# EAGLE design Artemis Corner Board V2 FR (EAGLE 7.5.0)
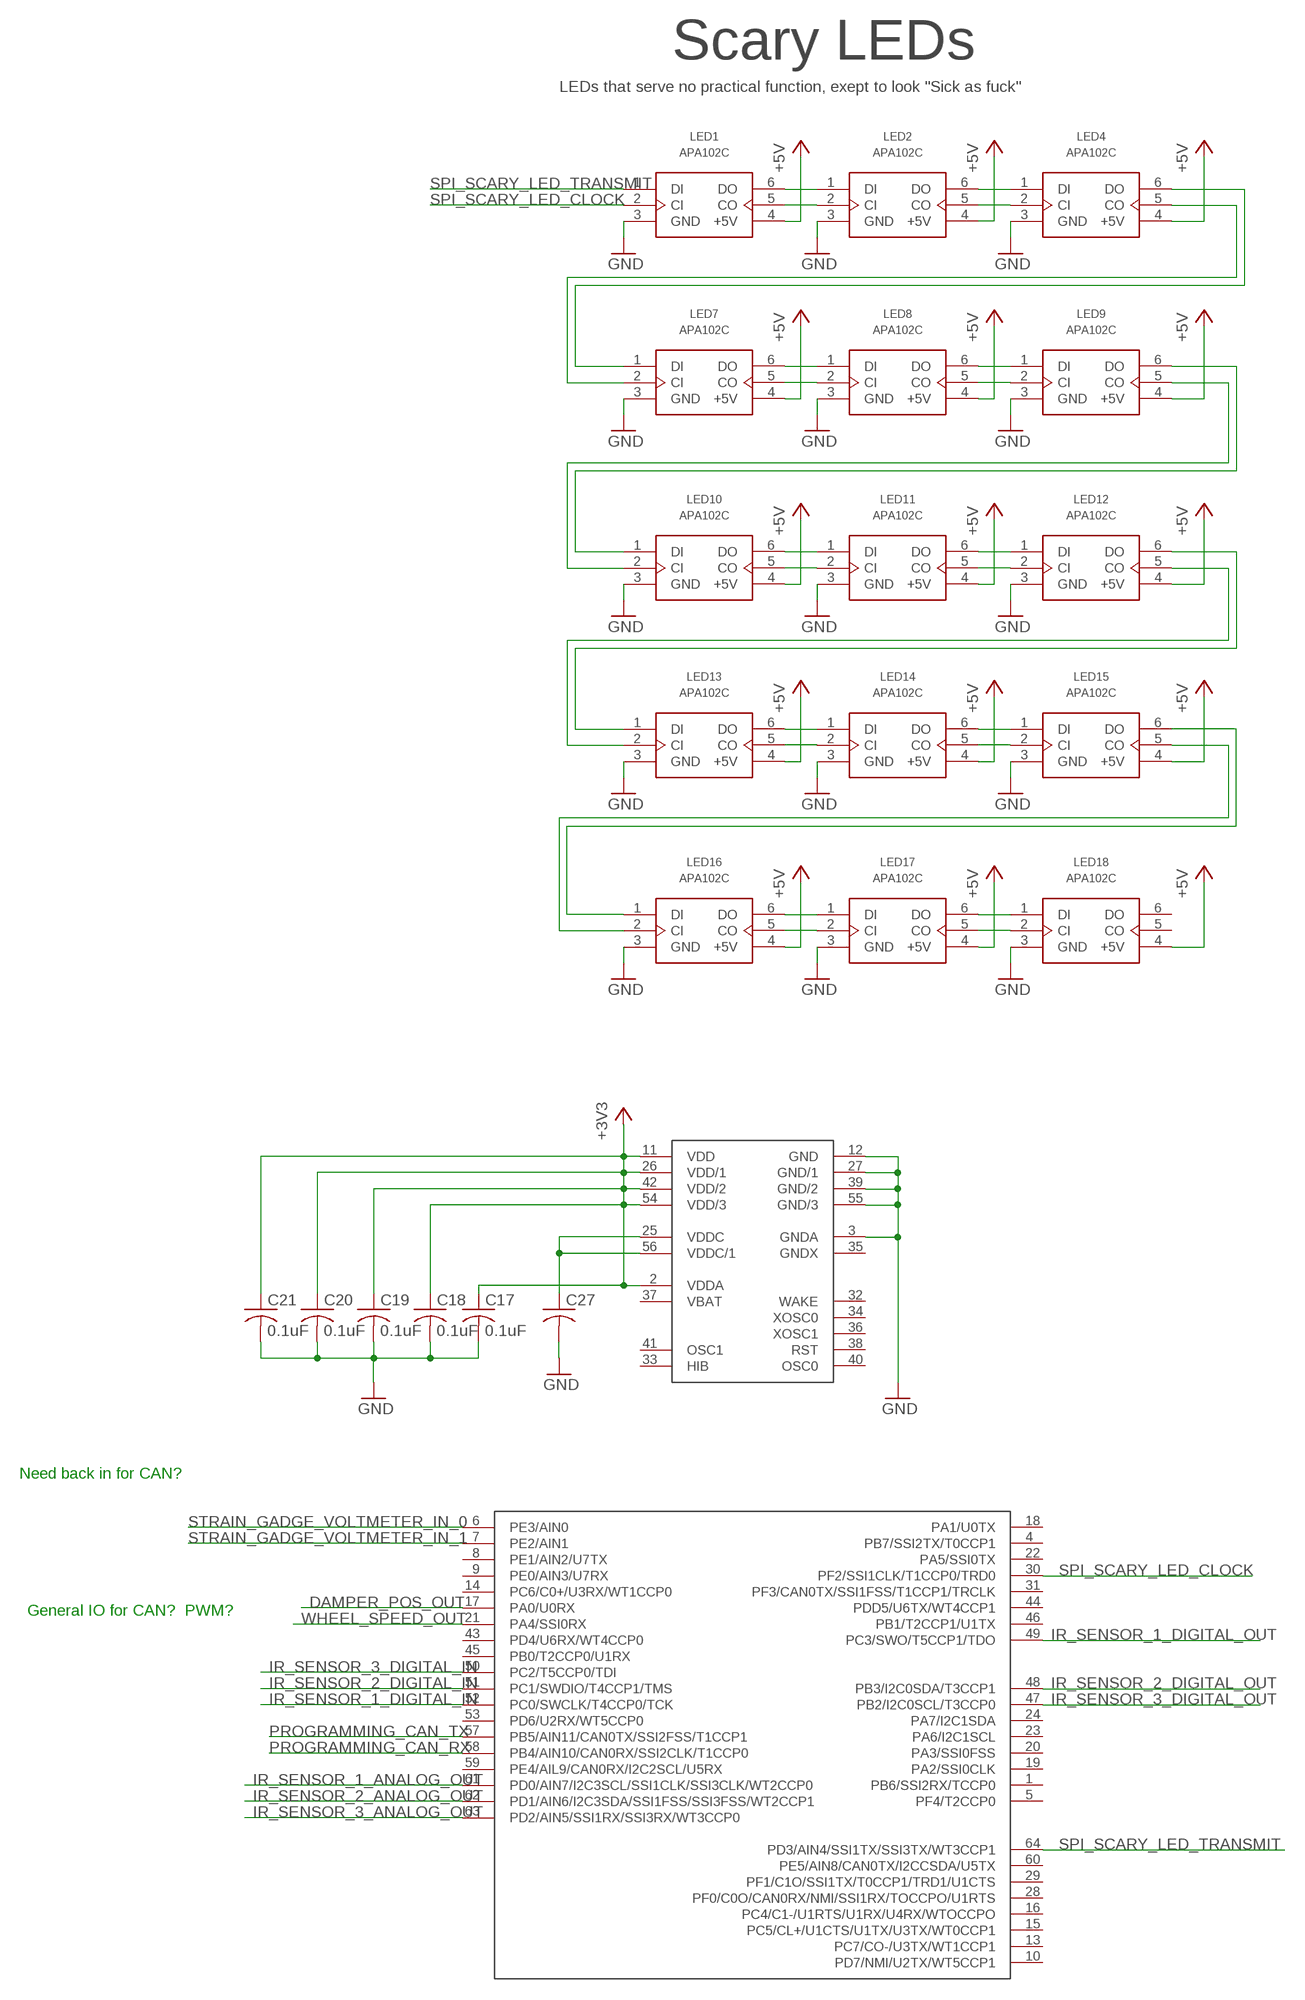
[diagram p0: schematic, sheet 1, part 1 of 2]
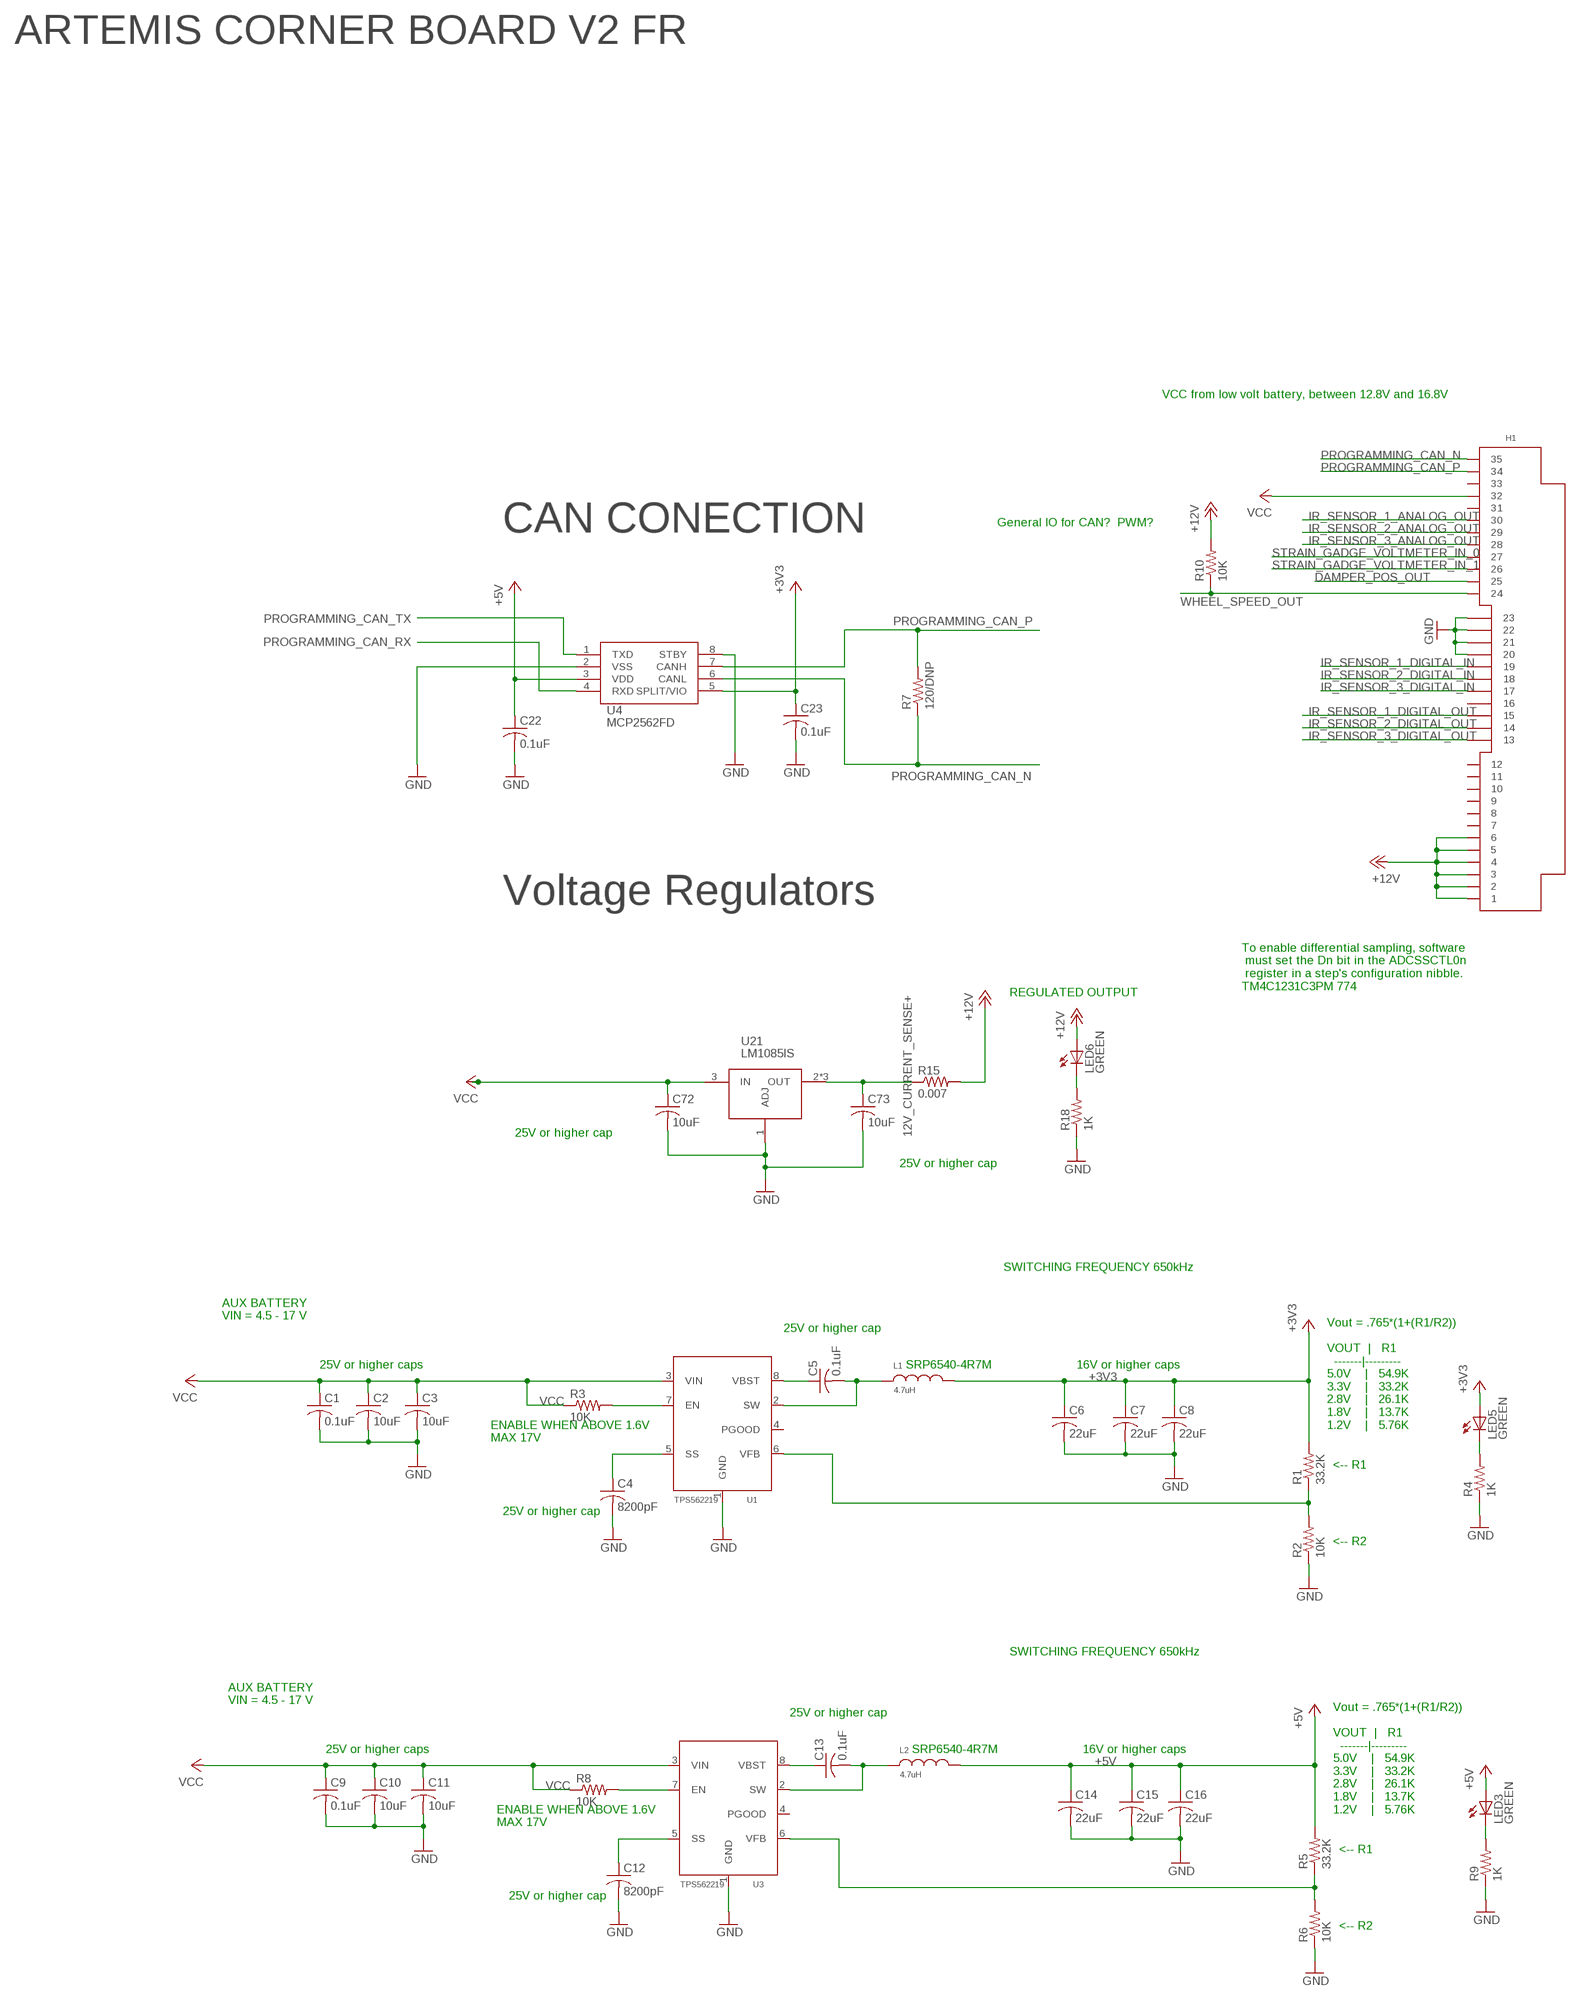
[diagram p1: schematic, sheet 1, part 2 of 2]

## Parts
C1  0.1uF  C-USC0805  [C0805]
C2  10uF  C-USC0805  [C0805]
C3  10uF  C-USC0805  [C0805]
C4  8200pF  C-USC0805  [C0805]
C5  0.1uF  C-USC0805  [C0805]
C6  22uF  C-USC0805  [C0805]
C7  22uF  C-USC0805  [C0805]
C8  22uF  C-USC0805  [C0805]
C9  0.1uF  C-USC0805  [C0805]
C10  10uF  C-USC0805  [C0805]
C11  10uF  C-USC0805  [C0805]
C12  8200pF  C-USC0805  [C0805]
C13  0.1uF  C-USC0805  [C0805]
C14  22uF  C-USC0805  [C0805]
C15  22uF  C-USC0805  [C0805]
C16  22uF  C-USC0805  [C0805]
C17  0.1uF  C-USC0805  [C0805]
C18  0.1uF  C-USC0805  [C0805]
C19  0.1uF  C-USC0805  [C0805]
C20  0.1uF  C-USC0805  [C0805]
C21  0.1uF  C-USC0805  [C0805]
C22  0.1uF  C-USC0805  [C0805]
C23  0.1uF  C-USC0805  [C0805]
C27  3.3uF  C-USC0805  [C0805]
C72  10uF  C-USC0805  [C0805]
C73  10uF  C-USC0805  [C0805]
H1  1-776231-1  [1-776231-1]
L1  4.7uH  SRP6540  [SRP6540]
L2  4.7uH  SRP6540  [SRP6540]
LED1  APA102C  [5050_LED]
LED2  APA102C  [5050_LED]
LED3  GREEN  LEDCHIPLED_0805  [CHIPLED_0805]
LED4  APA102C  [5050_LED]
LED5  GREEN  LEDCHIPLED_0805  [CHIPLED_0805]
LED6  GREEN  LEDCHIPLED_0805  [CHIPLED_0805]
LED7  APA102C  [5050_LED]
LED8  APA102C  [5050_LED]
LED9  APA102C  [5050_LED]
LED10  APA102C  [5050_LED]
LED11  APA102C  [5050_LED]
LED12  APA102C  [5050_LED]
LED13  APA102C  [5050_LED]
LED14  APA102C  [5050_LED]
LED15  APA102C  [5050_LED]
LED16  APA102C  [5050_LED]
LED17  APA102C  [5050_LED]
LED18  APA102C  [5050_LED]
R1  33.2K  R-US_R0805  [R0805]
R2  10K  R-US_R0805  [R0805]
R3  10K  R-US_R0805  [R0805]
R4  1K  R-US_R0805  [R0805]
R5  33.2K  R-US_R0805  [R0805]
R6  10K  R-US_R0805  [R0805]
R7  120/DNP  R-US_R0805  [R0805]
R8  10K  R-US_R0805  [R0805]
R9  1K  R-US_R0805  [R0805]
R10  10K  R-US_R0805  [R0805]
R15  0.007  R-US_R0805  [R0805]
R18  1K  R-US_R0805  [R0805]
U1  TPS562219  [TPS562219]
U2  TM4C1231C3PM  [TM4C1231C3PM]
U3  TPS562219  [TPS562219]
U4  MCP2562FD  MCP256X-SOIC  [SOIC8-N_MC]
U21  LM1085IS  LM1085  [TO-263]

## Nets
12V_CURRENT_SENSE+: C73.1 R15.1 U21.2(OUT) U21.GND1(OUT) U21.GND(OUT)
+3V3: C6.1 C7.1 C8.1 C17.1 C18.1 C19.1 C20.1 C21.1 C23.1 L1.P$2 LED5.A R1.2 U2.2(VDDA) U2.11(VDD) U2.26(VDD/1) U2.42(VDD/2) U2.54(VDD/3) U4.5(SPLIT/VIO)
+5V: C14.1 C15.1 C16.1 C22.1 L2.P$2 LED1.4(+5V) LED2.4(+5V) LED3.A LED4.4(+5V) LED7.4(+5V) LED8.4(+5V) LED9.4(+5V) LED10.4(+5V) LED11.4(+5V) LED12.4(+5V) LED13.4(+5V) LED14.4(+5V) LED15.4(+5V) LED16.4(+5V) LED17.4(+5V) LED18.4(+5V) R5.2 U4.3(VDD)
+12V: H1.1 H1.2 H1.3 H1.4 H1.5 H1.6 LED6.A R10.2 R15.2
DAMPER_POS_OUT: H1.25 U2.17(PA0/U0RX)
GND: C1.2 C2.2 C3.2 C4.2 C6.2 C7.2 C8.2 C9.2 C10.2 C11.2 C12.2 C14.2 C15.2 C16.2 C17.2 C18.2 C19.2 C20.2 C21.2 C22.2 C23.2 C27.2 C72.2 C73.2 H1.20 H1.21 H1.22 H1.23 LED1.3(GND) LED2.3(GND) LED4.3(GND) LED7.3(GND) LED8.3(GND) LED9.3(GND) LED10.3(GND) LED11.3(GND) LED12.3(GND) LED13.3(GND) LED14.3(GND) LED15.3(GND) LED16.3(GND) LED17.3(GND) LED18.3(GND) R2.1 R4.1 R6.1 R9.1 R18.1 U1.1(GND) U2.3(GNDA) U2.12(GND) U2.27(GND/1) U2.39(GND/2) U2.55(GND/3) U3.1(GND) U4.2(VSS) U4.8(STBY) U21.1(ADJ)
IR_SENSOR_1_ANALOG_OUT: H1.30 U2.61(PD0/AIN7/I2C3SCL/SSI1CLK/SSI3CLK/WT2CCP0)
IR_SENSOR_1_DIGITAL_IN: H1.19 U2.52(PC0/SWCLK/T4CCP0/TCK)
IR_SENSOR_1_DIGITAL_OUT: H1.15 U2.49(PC3/SWO/T5CCP1/TDO)
IR_SENSOR_2_ANALOG_OUT: H1.29 U2.62(PD1/AIN6/I2C3SDA/SSI1FSS/SSI3FSS/WT2CCP1)
IR_SENSOR_2_DIGITAL_IN: H1.18 U2.51(PC1/SWDIO/T4CCP1/TMS)
IR_SENSOR_2_DIGITAL_OUT: H1.14 U2.48(PB3/I2C0SDA/T3CCP1)
IR_SENSOR_3_ANALOG_OUT: H1.28 U2.63(PD2/AIN5/SSI1RX/SSI3RX/WT3CCP0)
IR_SENSOR_3_DIGITAL_IN: H1.17 U2.50(PC2/T5CCP0/TDI)
IR_SENSOR_3_DIGITAL_OUT: H1.13 U2.47(PB2/I2C0SCL/T3CCP0)
N$1: LED1.6(DO) LED2.1(DI)
N$2: LED5.C R4.2
N$3: LED3.C R9.2
N$4: R8.2 U3.7(EN)
N$5: LED7.6(DO) LED8.1(DI)
N$6: LED8.6(DO) LED9.1(DI)
N$7: LED8.5(CO) LED9.2(CI)
N$8: LED7.5(CO) LED8.2(CI)
N$9: R3.2 U1.7(EN)
N$10: LED2.6(DO) LED4.1(DI)
N$11: LED6.C R18.2
N$12: LED4.5(CO) LED7.2(CI)
N$13: LED4.6(DO) LED7.1(DI)
N$14: LED10.6(DO) LED11.1(DI)
N$15: LED2.5(CO) LED4.2(CI)
N$16: LED1.5(CO) LED2.2(CI)
N$19: LED11.6(DO) LED12.1(DI)
N$20: LED11.5(CO) LED12.2(CI)
N$21: LED10.5(CO) LED11.2(CI)
N$22: LED9.6(DO) LED10.1(DI)
N$23: LED9.5(CO) LED10.2(CI)
N$24: LED13.6(DO) LED14.1(DI)
N$25: LED14.6(DO) LED15.1(DI)
N$26: LED14.5(CO) LED15.2(CI)
N$27: LED13.5(CO) LED14.2(CI)
N$28: LED12.6(DO) LED13.1(DI)
N$29: LED12.5(CO) LED13.2(CI)
N$30: LED16.6(DO) LED17.1(DI)
N$31: LED17.6(DO) LED18.1(DI)
N$32: LED17.5(CO) LED18.2(CI)
N$33: LED16.5(CO) LED17.2(CI)
N$34: LED15.5(CO) LED16.2(CI)
N$35: LED15.6(DO) LED16.1(DI)
P$40: C27.1 U2.25(VDDC) U2.56(VDDC/1)
PROGRAMMING_CAN_N [diffPairs]: H1.35 R7.1 U4.6(CANL)
PROGRAMMING_CAN_P [diffPairs]: H1.34 R7.2 U4.7(CANH)
PROGRAMMING_CAN_RX: U2.58(PB4/AIN10/CAN0RX/SSI2CLK/T1CCP0) U4.4(RXD)
PROGRAMMING_CAN_TX: U2.57(PB5/AIN11/CAN0TX/SSI2FSS/T1CCP1) U4.1(TXD)
SPI_SCARY_LED_CLOCK: LED1.2(CI) U2.30(PF2/SSI1CLK/T1CCP0/TRD0)
SPI_SCARY_LED_TRANSMIT: LED1.1(DI) U2.64(PD3/AIN4/SSI1TX/SSI3TX/WT3CCP1)
SS_5V1: C4.1 U1.5(SS)
SS_5V2: C12.1 U3.5(SS)
STRAIN_GADGE_VOLTMETER_IN_0: H1.27 U2.6(PE3/AIN0)
STRAIN_GADGE_VOLTMETER_IN_1: H1.26 U2.7(PE2/AIN1)
SW_5V1: C5.2 L1.P$1 U1.2(SW)
SW_5V2: C13.2 L2.P$1 U3.2(SW)
VBST_5V1: C5.1 U1.8(VBST)
VBST_5V2: C13.1 U3.8(VBST)
VCC: C1.1 C2.1 C3.1 C9.1 C10.1 C11.1 C72.1 H1.32 R3.1 R8.1 U1.3(VIN) U3.3(VIN) U21.3(IN)
VFB_5V1: R1.1 R2.2 U1.6(VFB)
VFB_5V2: R5.1 R6.2 U3.6(VFB)
WHEEL_SPEED_OUT: H1.24 R10.1 U2.21(PA4/SSI0RX)
Unconnected: H1.7 H1.8 H1.9 H1.10 H1.11 H1.12 H1.16 H1.31 H1.33 LED18.5(CO) LED18.6(DO) U1.4(PGOOD) U2.1(PB6/SSI2RX/TCCP0) U2.4(PB7/SSI2TX/T0CCP1) U2.5(PF4/T2CCP0) U2.8(PE1/AIN2/U7TX) U2.9(PE0/AIN3/U7RX) U2.10(PD7/NMI/U2TX/WT5CCP1) U2.13(PC7/CO-/U3TX/WT1CCP1) U2.14(PC6/C0+/U3RX/WT1CCP0) U2.15(PC5/CL+/U1CTS/U1TX/U3TX/WT0CCP1) U2.16(PC4/C1-/U1RTS/U1RX/U4RX/WTOCCPO) U2.18(PA1/U0TX) U2.19(PA2/SSI0CLK) U2.20(PA3/SSI0FSS) U2.22(PA5/SSI0TX) U2.23(PA6/I2C1SCL) U2.24(PA7/I2C1SDA) U2.28(PF0/C0O/CAN0RX/NMI/SSI1RX/TOCCPO/U1RTS) U2.29(PF1/C1O/SSI1TX/T0CCP1/TRD1/U1CTS) U2.31(PF3/CAN0TX/SSI1FSS/T1CCP1/TRCLK) U2.32(WAKE) U2.33(HIB) U2.34(XOSC0) U2.35(GNDX) U2.36(XOSC1) U2.37(VBAT) U2.38(RST) U2.40(OSC0) U2.41(OSC1) U2.43(PD4/U6RX/WT4CCP0) U2.44(PDD5/U6TX/WT4CCP1) U2.45(PB0/T2CCP0/U1RX) U2.46(PB1/T2CCP1/U1TX) U2.53(PD6/U2RX/WT5CCP0) U2.59(PE4/AIL9/CAN0RX/I2C2SCL/U5RX) U2.60(PE5/AIN8/CAN0TX/I2CCSDA/U5TX) U3.4(PGOOD)

## Notes on the sheet
- ARTEMIS CORNER BOARD V2 FR
- Scary LEDs
- LEDs that serve no practical function, exept to look "Sick as fuck"
- VCC from low volt battery, between 12.8V and 16.8V
- General IO for CAN?  PWM?
- CAN CONECTION
- Voltage Regulators
- To enable differential sampling, software
   must set the Dn bit in the ADCSSCTL0n
   register in a step's configuration nibble.
  TM4C1231C3PM 774
- REGULATED OUTPUT
- 25V or higher cap
- 25V or higher cap
- SWITCHING FREQUENCY 650kHz
- Need back in for CAN?
- AUX BATTERY
  VIN = 4.5 - 17 V
- 25V or higher cap
- 25V or higher caps | SRP6540-4R7M | 16V or higher caps
- General IO for CAN?  PWM?
- ENABLE WHEN ABOVE 1.6V
  MAX 17V
- Vout = .765*(1+(R1/R2))
  
  VOUT  |   R1
    -------|---------
  5.0V    |   54.9K
  3.3V    |   33.2K
  2.8V    |   26.1K
  1.8V    |   13.7K
  1.2V    |   5.76K
- 25V or higher cap
- <-- R1
  
  
  
  
  
  <-- R2
- SWITCHING FREQUENCY 650kHz
- AUX BATTERY
  VIN = 4.5 - 17 V
- 25V or higher cap
- 25V or higher caps | SRP6540-4R7M | 16V or higher caps
- ENABLE WHEN ABOVE 1.6V
  MAX 17V
- Vout = .765*(1+(R1/R2))
  
  VOUT  |   R1
    -------|---------
  5.0V    |   54.9K
  3.3V    |   33.2K
  2.8V    |   26.1K
  1.8V    |   13.7K
  1.2V    |   5.76K
- 25V or higher cap
- <-- R1
  
  
  
  
  
  <-- R2

## Library data of the parts
C1 C5 C9 C13 = adafruit:C-US: CAPACITOR, American symbol; PARTNO: GRM21BR71E104KA01L
C2 C3 C10 C11 C72 C73 = adafruit:C-US: CAPACITOR, American symbol; PARTNO: GRM21BR61E106KA73L
C4 C12 = adafruit:C-US: CAPACITOR, American symbol; PARTNO: C0805C822K5RACTU
C6-C8 C14-C16 = adafruit:C-US: CAPACITOR, American symbol; PARTNO: C2012JB1E226M125AC
C17-C23 = rcl:C-US: CAPACITOR, American symbol; PARTNO: GRM21BR71H104KA01L
C27 = rcl:C-US: CAPACITOR, American symbol; MPN: C1005X7R1E104K050BB; OC_NEWARK: 04X3227; PARTNO: GRM21BR71E104KA01L
H1 = FormE:1-776231-1: 35 Pin sealed Connector Panel Mount
L1 L2 = FormE:SRP6540; PARTNO: SRP6540-4R7M
LED1 LED2 LED4 LED7-LED18 = FormE:APA102C
LED3 LED5 LED6 = FormE:LED: LED OSRAM: - CHIPLED LG R971, LG N971, LY N971, LG Q971, LY Q971, LO R971, LY R971 LH N974, LH R974 LS Q976, LO Q976, LY Q976 LO Q996 - Hyper CHIPLED LW Q18S LB Q993, LB Q99A, LB R99A - SideLED LS A670, LO A670, LY A670, LG A670, LP A670 LB A673, LV A673, LT A673, LW A673 LH A674 LY A675 LS A676, LA A676, LO A676, LY A676, LW A676 LS A679, LY A679, LG A679 - Hyper Micro SIDELED® LS Y876, LA Y876, LO Y876, LY Y876 LT Y87S - SmartLED LW L88C, LW L88S LB L89C, LB L89S, LG L890 LS L89K, LO L89K, LY L89K LS L896, LA L896, LO L896, LY L896 - TOPLED LS T670, LO T670, LY T670, LG T670, LP T670 LSG T670, LSP T670, LSY T670, LOP T670, LYG T670 LG T671, LOG T671, LSG T671 LB T673, LV T673, LT T673, LW T673 LH T674 LS T676, LA T676, LO T676, LY T676, LB T676, LH T676, LSB T676, LW T676 LB T67C, LV T67C, LT T67C, LS T67K, LO T67K, LY T67K, LW E67C LS E67B, LA E67B, LO E67B, LY E67B, LB E67C, LV E67C, LT E67C LW T67C LS T679, LY T679, LG T679 LS T770, LO T770, LY T770, LG T770, LP T770 LB T773, LV T773, LT T773, LW T773 LH T774 LS E675, LA E675, LY E675, LS T675 LS T776, LA T776, LO T776, LY T776, LB T776 LHGB T686 LT T68C, LB T68C - Hyper Mini TOPLED® LB M676 - Mini TOPLED Santana® LG M470 LS M47K, LO M47K, LY M47K Source: http://www.osram.convergy.de/; PARTNO: 598-8170-107F
R1 R5 = adafruit:R-US_: RESISTOR, American symbol; PARTNO: ERA-6AEB5492V
R2 R3 R6 R8 R10 = adafruit:R-US_: RESISTOR, American symbol; PARTNO: ERJ-6ENF1002V
R4 R9 R18 = adafruit:R-US_: RESISTOR, American symbol; PARTNO: ERJ-6ENF1001V
R7 = rcl:R-US_: RESISTOR, American symbol; PARTNO: *
R15 = adafruit:R-US_: RESISTOR, American symbol; PARTNO: PMR10EZPFU7L00
U1 U3 = FormE:TPS562219; PARTNO: TPS562219DDFT
U2 = FormE:TM4C1231C3PM
U4 = FormE:MCP256X: MCP2561/2 CAN Transceiver Microchip High-Speed CAN Transceiver Datasheet <http://ww1.microchip.com/downloads/en/DeviceDoc/20005167C.pdf>; PARTNO: MCP2562FD-E/SN
U21 = FormE:LM1085; PARTNO: LM1085IS-12/NOPB

## Net classes
0 default: width 0.254 mm, drill 0.5 mm, clearance 0.254 mm
1 diffPairs: width 0.254 mm, drill 0.5 mm, clearance 0.254 mm

## Board
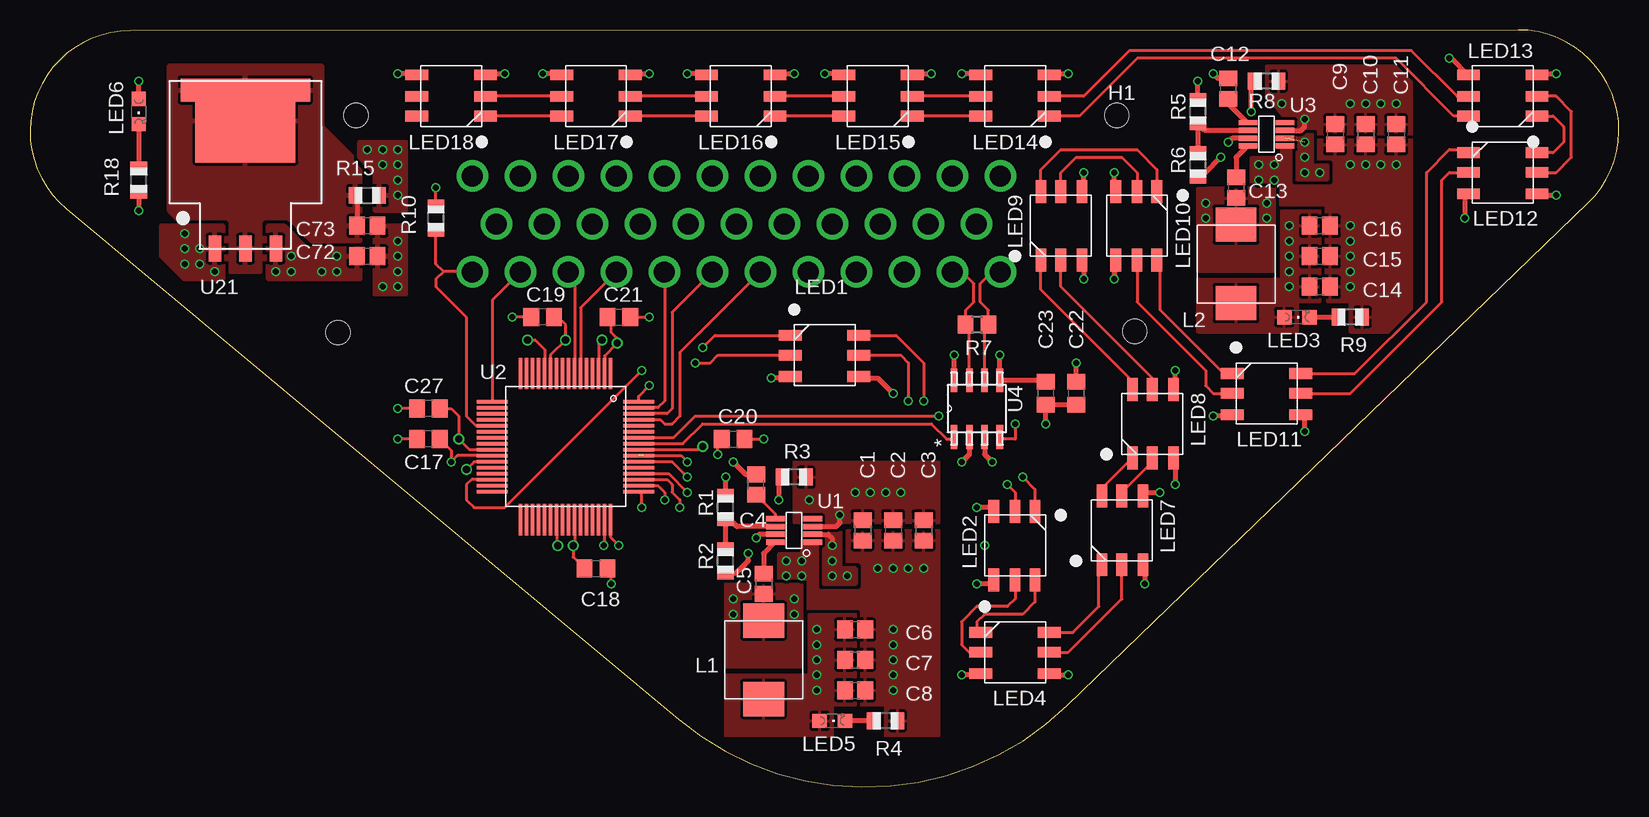
[diagram p2: board, top side]
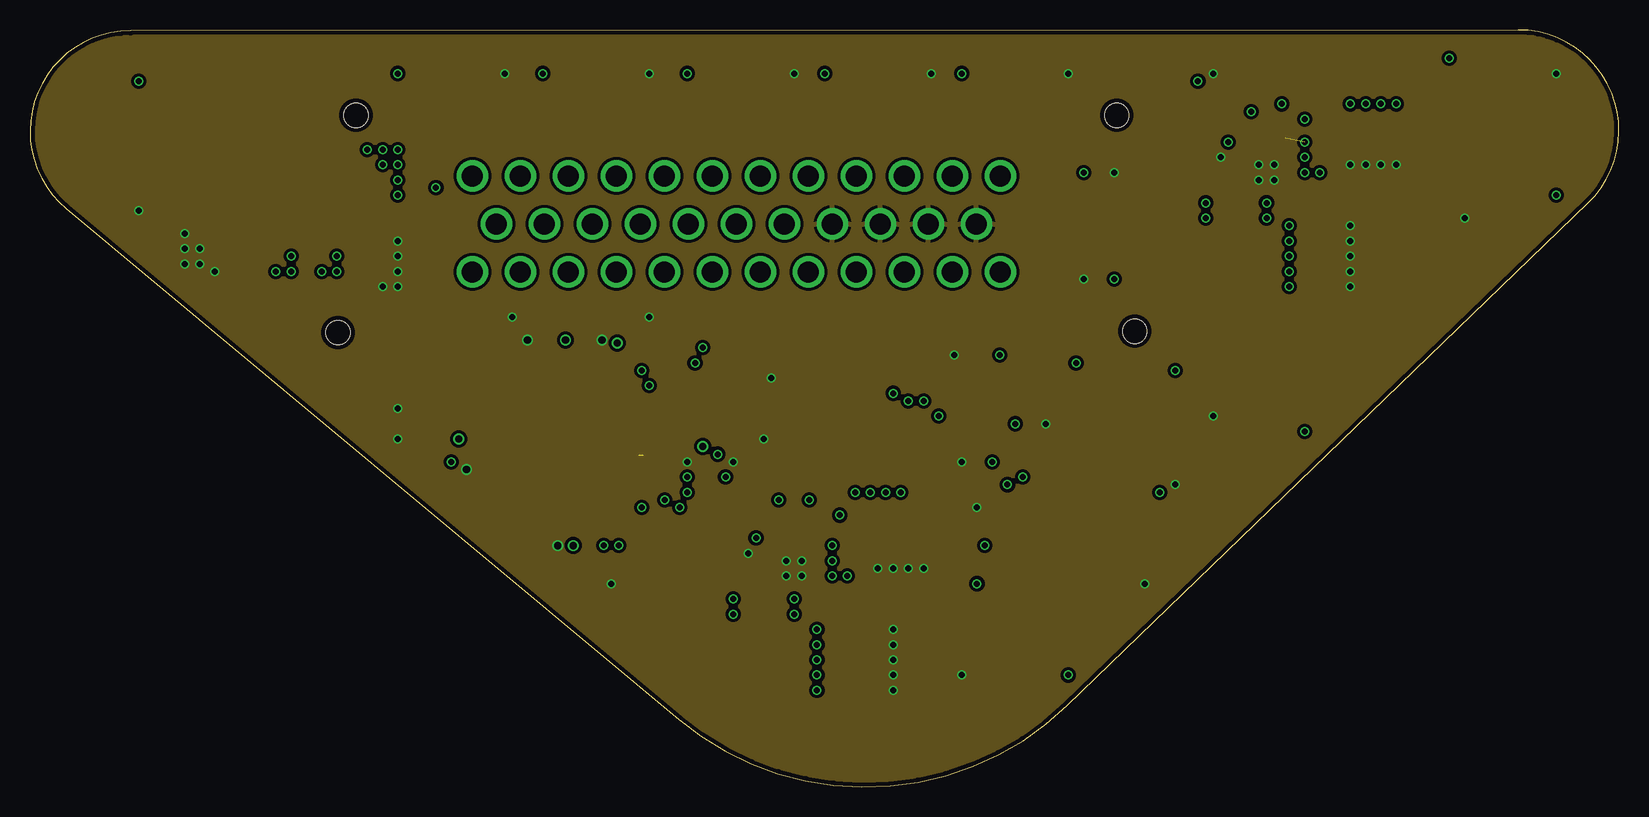
[diagram p3: board, inner layer Route2]
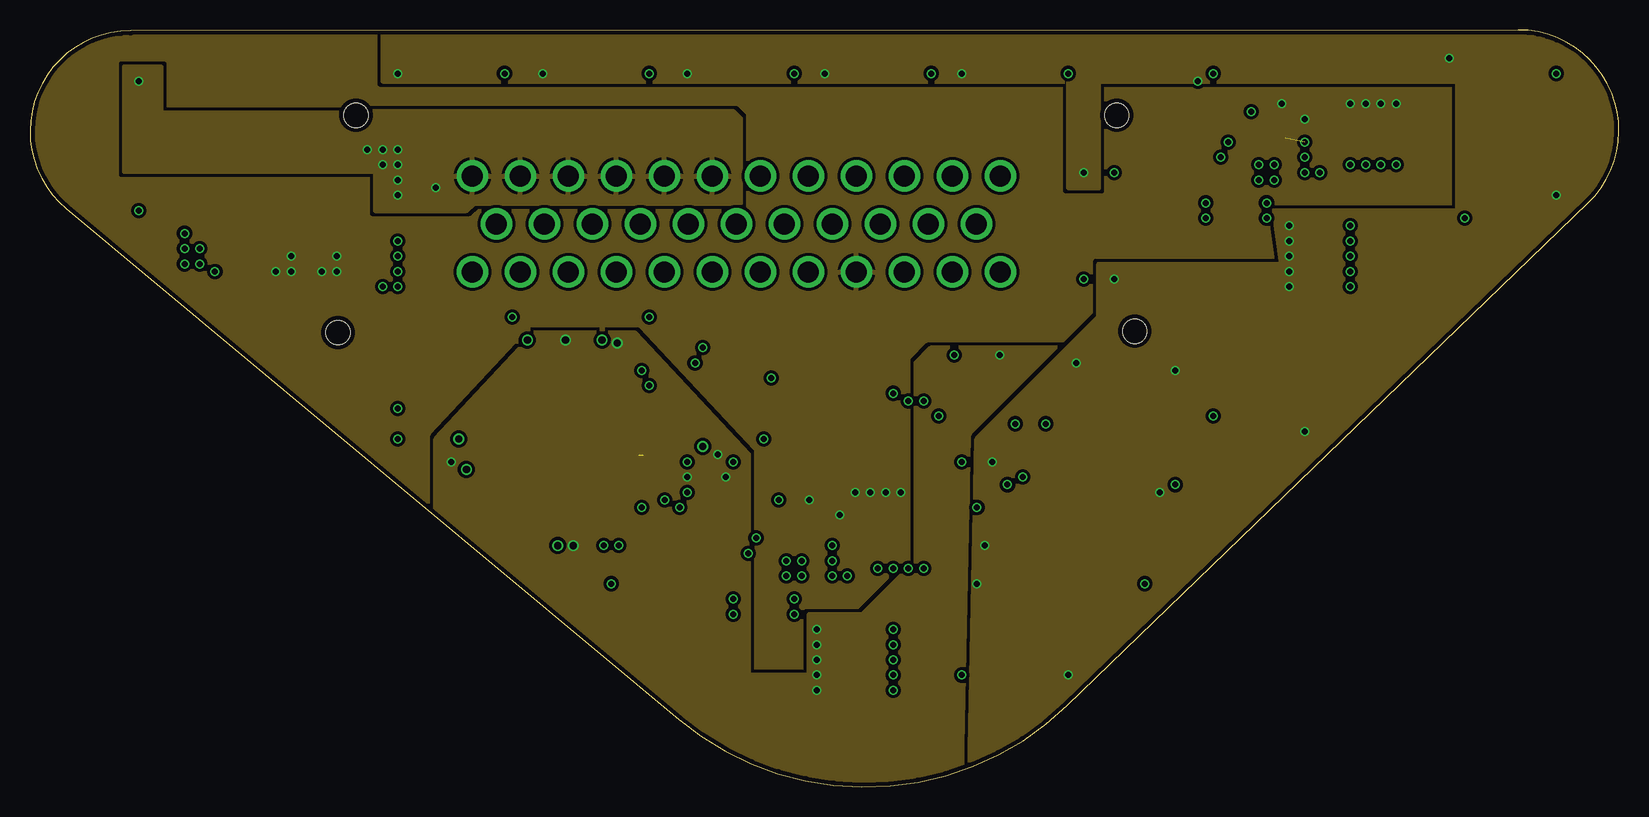
[diagram p4: board, inner layer Route15]
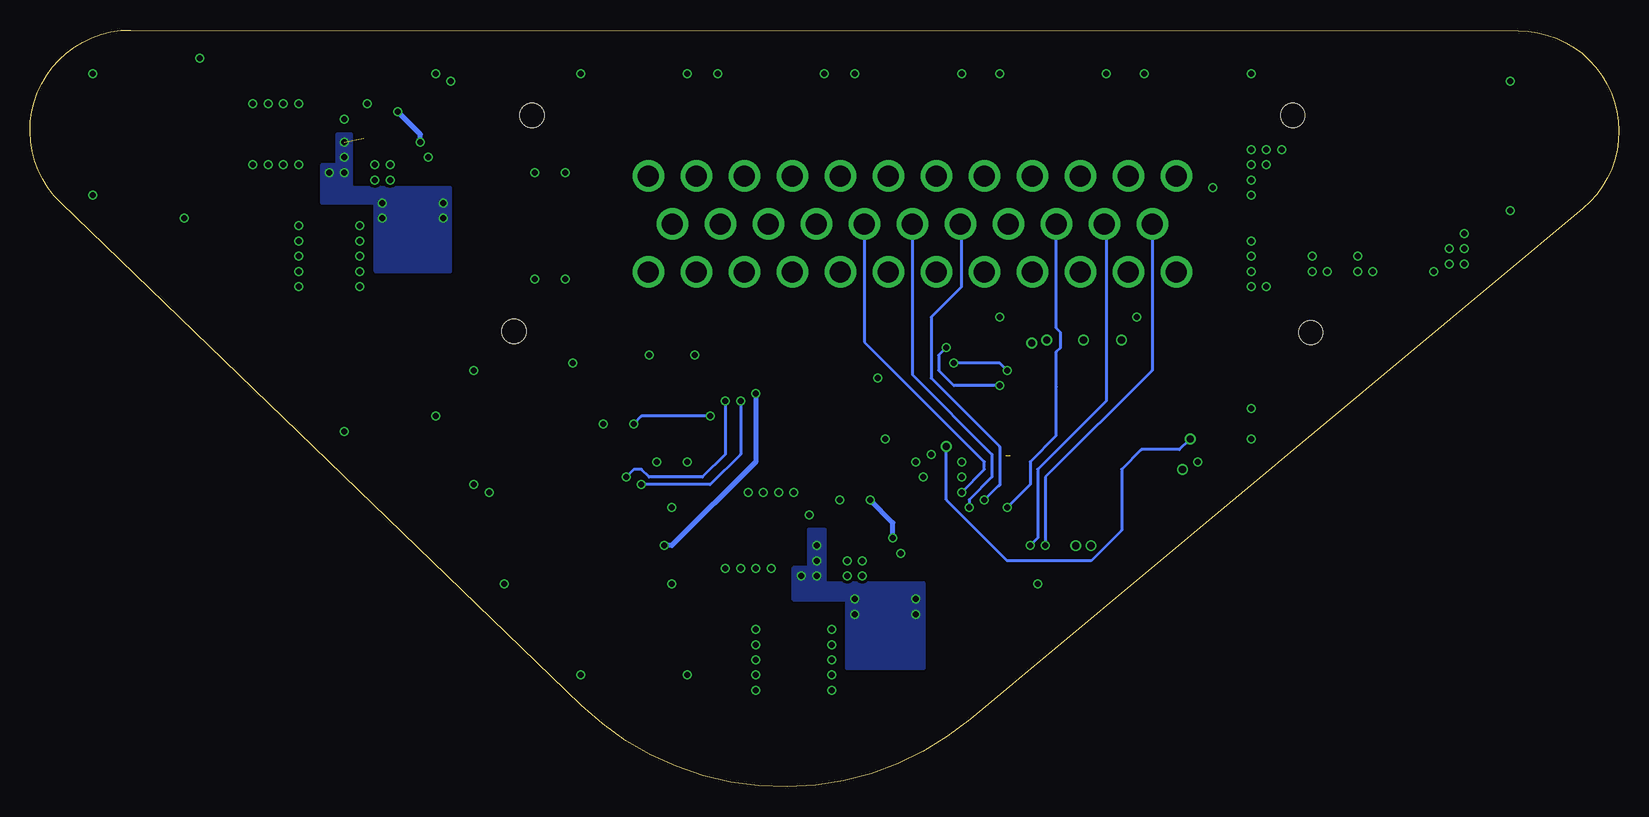
[diagram p5: board, bottom side, seen from below]

Size 132.41 x 63.12 mm. Coordinates in mm from the lower left corner, seen from the top.
Outline: 86.46,6.81 129.85,48.71 arc136 124.02,63.12 8.38,63.06 arc140 3.01,48.24 54.07,5.63 arc84 86.46,6.81
Copper layers (1*2*15*16): Top 0.035559375mm / dielectric 0.17018125mm / Route2 0.01778125mm / dielectric 47mil / Route15 0.01778125mm / dielectric 0.17018125mm / Bottom 0.035559375mm
Design rules "OSHPark-4layer": minimum track width 5mil, minimum drill 10mil, track to track 5mil, track to pad 5mil, pad to pad 5mil, via to via 5mil, smd to smd 5mil, copper to edge 15mil, drill to drill 6mil, minimum pad ring 4mil, minimum via ring 4mil, stop-mask expansion 4mil, vias tented up to drill 0mil, thermal gap 10mil

### Footprints (pad centres in the part's own frame; a part is rotated, then mirrored left to right if it is on the bottom)
C0805 = smd 1.3 x 1.5: 1 -0.85,0; 2 0.85,0
C0805' = smd 1.3 x 1.5: 1 -0.95,0; 2 0.95,0
1-776231-1 = drill 1.75: 1 -22,4; 2 -18,4; 3 -14,4; 4 -10,4; 5 -6,4; 6 -2,4; 7 2,4; 8 6,4; 9 10,4; 10 14,4; 11 18,4; 12 22,4; 13 -20,0; 14 -16,0; 15 -12,0; 16 -8,0; 17 -4,0; 18 0,0; 19 4,0; 20 8,0; 21 12,0; 22 16,0; 23 20,0; 24 -22,-4; 25 -18,-4; 26 -14,-4; 27 -10,-4; 28 -6,-4; 29 -2,-4; 30 2,-4; 31 6,-4; 32 10,-4; 33 14,-4; 34 18,-4; 35 22,-4 | hole 2: 31.7,9.05; -31.7,9.05; -33.2,-9.05; 33.2,-8.95
SRP6540 = smd 2.85 x 3.4: P$1 -3.275,0; P$2 3.275,0
5050_LED = smd 1.905 x 0.889: 1 -0.318,4.191; 2 -0.318,2.54; 3 -0.318,0.762; 4 5.397,0.762; 5 5.397,2.54; 6 5.397,4.191
CHIPLED_0805 = smd 1.2 x 1.2: A 0,-1.05; C 0,1.05
R0805 = smd 1.1 x 1.4: 1 -1,0; 2 1,0
R0805' = smd 1.3 x 1.5: 1 -0.95,0; 2 0.95,0
TPS562219 = smd 1.55 x 0.45: 1 -1.55,0.975; 2 -1.55,0.325; 3 -1.55,-0.325; 4 -1.55,-0.975; 5 1.55,-0.975; 6 1.55,-0.325; 7 1.55,0.325; 8 1.55,0.975
TM4C1231C3PM = smd 2.6 x 0.3: 1 -6.1,3.75; 2 -6.1,3.25; 3 -6.1,2.75; 4 -6.1,2.25; 5 -6.1,1.75; 6 -6.1,1.25; 7 -6.1,0.75; 8 -6.1,0.25; 9 -6.1,-0.25; 10 -6.1,-0.75; 11 -6.1,-1.25; 12 -6.1,-1.75; 13 -6.1,-2.25; 14 -6.1,-2.75; 15 -6.1,-3.25; 16 -6.1,-3.75; 33 6.1,-3.75; 34 6.1,-3.25; 35 6.1,-2.75; 36 6.1,-2.25; 37 6.1,-1.75; 38 6.1,-1.25; 39 6.1,-0.75; 40 6.1,-0.25; 41 6.1,0.25; 42 6.1,0.75; 43 6.1,1.25; 44 6.1,1.75; 45 6.1,2.25; 46 6.1,2.75; 47 6.1,3.25; 48 6.1,3.75 | smd 0.3 x 2.6: 17 -3.75,-6.1; 18 -3.25,-6.1; 19 -2.75,-6.1; 20 -2.25,-6.1; 21 -1.75,-6.1; 22 -1.25,-6.1; 23 -0.75,-6.1; 24 -0.25,-6.1; 25 0.25,-6.1; 26 0.75,-6.1; 27 1.25,-6.1; 28 1.75,-6.1; 29 2.25,-6.1; 30 2.75,-6.1; 31 3.25,-6.1; 32 3.75,-6.1; 49 3.75,6.1; 50 3.25,6.1; 51 2.75,6.1; 52 2.25,6.1; 53 1.75,6.1; 54 1.25,6.1; 55 0.75,6.1; 56 0.25,6.1; 57 -0.25,6.1; 58 -0.75,6.1; 59 -1.25,6.1; 60 -1.75,6.1; 61 -2.25,6.1; 62 -2.75,6.1; 63 -3.25,6.1; 64 -3.75,6.1
SOIC8-N_MC = smd 1.981 x 0.559: 1 -2.362,1.905; 2 -2.362,0.635; 3 -2.362,-0.635; 4 -2.362,-1.905; 5 2.362,-1.905; 6 2.362,-0.635; 7 2.362,0.635; 8 2.362,1.905
TO-263 = smd 2.159 x 1.067: 1 6.35,-2.54; 2 6.35,0; 3 6.35,2.54 | smd 1.905 x 10.795: GND -6.871,0 | smd 6.985 x 8.331: GND1 -4.331,0

### Placement (x,y rotation side)
C1  69.39,21.4 270 top
C2  71.93,21.4 270 top
C3  74.47,21.4 270 top
C4  60.5,25.21 90 top
C5  61.14,16.95 270 top
C6  68.76,13.14 0 top
C7  68.76,10.6 0 top
C8  68.76,8.06 0 top
C9  108.76,54.42 270 top
C10  111.3,54.42 270 top
C11  113.84,54.42 270 top
C12  99.87,58.23 90 top
C13  100.51,49.97 270 top
C14  107.49,41.72 0 top
C15  107.49,44.26 0 top
C16  107.49,46.8 0 top
C17  0.1uF  [C0805']  33.2,29.02 180 top
C18  0.1uF  [C0805']  47.17,18.22 0 top
C19  0.1uF  [C0805']  42.72,39.18 180 top
C20  0.1uF  [C0805']  58.6,29.02 0 top
C21  0.1uF  [C0805']  49.07,39.18 0 top
C22  0.1uF  [C0805']  87.17,32.83 270 top
C23  0.1uF  [C0805']  84.63,32.83 270 top
C27  3.3uF  [C0805']  33.2,31.56 180 top
C72  28.12,44.26 0 top
C73  28.12,46.8 0 top
H1  58.87,46.95 0 top
L1  61.14,10.6 270 top
L2  100.51,43.62 270 top
LED1  63.68,33.46 0 top
LED2  79.55,22.67 270 top
LED3  105.59,39.18 270 top
LED4  79.55,8.7 0 top
LED5  66.85,5.52 270 top
LED6  9.07,56.32 180 top
LED7  93.52,18.86 90 top
LED8  96.06,27.75 90 top
LED9  88.44,44.26 90 top
LED10  89.71,49.34 270 top
LED11  100.51,30.29 0 top
LED12  120.19,48.7 0 top
LED13  125.27,60.13 180 top
LED14  84.63,60.13 180 top
LED15  73.2,60.13 180 top
LED16  61.77,60.13 180 top
LED17  49.71,60.13 180 top
LED18  37.64,60.13 180 top
R1  57.96,23.3 90 top
R2  57.96,18.86 90 top
R3  63.68,25.84 180 top
R4  71.3,5.52 180 top
R5  97.33,56.32 90 top
R6  97.33,51.88 90 top
R7  120/DNP  [R0805']  78.92,38.54 180 top
R8  103.05,58.86 180 top
R9  110.03,39.18 180 top
R10  33.83,47.43 90 top
R15  28.12,49.34 0 top
R18  9.07,50.61 90 top
U1  63.68,21.4 180 top
U2  44.63,28.38 270 top
U3  103.05,54.42 180 top
U4  78.92,31.56 90 top
U21  17.96,51.24 270 top

### Tracks (layer width: path | path; a pad name or v marks a point on that pad's centre or on a via)
12V_CURRENT_SENSE+
  Top 0.406: R15.1 27.27,49.34 C73.1
  pour Top (rank 2): 27.48,45.53 21.77,45.53 19.23,42.99 16.69,42.99 11.61,48.07 11.61,60.13 24.31,60.13 24.31,55.05 27.48,51.88
+3V3  (via drill 0.5, 0.6)
  Top 0.254: U2.11 43.38,35.35 43.36,35.37 43.36,36 v44.63,37.27 44.63,38.54 43.99,39.18 C19.1 43.67,38.86 | U2.26 35.62,27.63 v35.1,27.11 35.1,28.06 C17.1 | U2.54 53.5,27.13 v54.79,25.84 | v57.33,27.75 57.33,28.7 C20.1 | U2.42 45.38,20.24 v45.26,20.13 45.26,19.18 C18.1 | U2.2 47.88,35.95 v48.94,37.02 48.94,37.4 48.44,37.91 48.44,38.54 48.12,38.86 C21.1
  Top 0.406: R1.2 v57.96,25.84 | v80.82,36 U4.5 84.49,33.92 C23.1
  other vias: 65.58,9.33 65.58,8.06 65.58,10.6 65.58,11.87 65.58,13.14
  pour Top: 57.96,9.33 64.95,9.33 64.95,14.41 68.76,14.41 68.76,6.79 66.85,6.79 66.85,4.25 57.96,4.25
  pour Route15 (rank 2): 78.28,-0.83 52.25,-0.83 33.83,21.4 33.83,29.02 42.09,37.91 50.34,37.91 59.87,27.75 59.87,9.33 64.95,9.33 64.95,14.41 69.39,14.41 73.84,18.86 73.84,35.37 75.11,36.64 85.9,36.64 78.28,29.02
+5V  (via drill 0.5)
  Top 0.406: C22.1 v87.17,35.37 | R5.2 v97.33,58.86 | U4.3 79.55,27.75 v80.19,27.11 | LED18.4 32.12,59.5 v30.66,59.5 | LED17.4 44.18,59.5 v42.72,59.5 | LED16.4 56.25,59.5 v54.79,59.5 | LED15.4 67.68,59.5 v66.22,59.5 | LED13.4 118.48,60.77 v118.29,60.77 | LED12.4 125.72,49.34 v127.18,49.34 | 106.03,30.92 LED11.4 106.09,31.05 106.22,30.92 v106.22,29.65 | LED8.4 95.43,33.27 v95.43,34.73 | LED7.4 93.08,24.57 v94.16,24.57 | LED2.4 80,16.95 v78.92,16.95 | LED4.4 85.08,9.33 v86.54,9.33 | LED1.4 69.2,34.1 70.66,34.1 v71.93,32.83 | LED9.4 87.81,49.78 v87.81,51.24 | LED10.4 90.35,43.81 v90.35,42.35 | LED14.4 79.11,59.5 v77.65,59.5
  Bottom 0.406: v71.93,32.83 71.93,27.11 78.92,20.13 v79.55,20.13
  other vias: 104.95,41.72 104.95,42.99 104.95,44.26 104.95,45.53 104.95,46.8
  pour Top: 97.33,42.35 104.32,42.35 104.32,48.07 107.49,48.07 107.49,40.45 105.59,40.45 105.59,37.91 97.33,37.91
  pour Route15: 103.68,48.07 130.35,48.07 130.35,-0.19 78.28,-0.83 78.92,29.02 89.08,39.18 89.08,43.62 104.32,43.62
  pour Route15: 118.92,48.07 132.89,48.07 132.89,63.31 29.39,63.31 29.39,58.86 86.54,58.86 86.54,49.97 89.08,49.97 89.08,58.86 118.92,58.86
+12V  (via drill 0.5)
  Top 0.254: R10.2 v33.83,49.97
  Top 0.406: LED6.A v9.07,58.86
  other vias: 30.66,49.34 30.66,50.61 30.66,51.88 30.66,53.15 29.39,53.15 29.39,51.88 28.12,53.15
  pour Top: 28.75,48.07 28.75,51.24 27.48,52.51 27.48,53.78 31.29,53.78 31.29,48.07
  pour Route15: 28.75,48.07 36.37,48.07 37.01,48.7 59.23,48.7 59.23,55.69 58.6,56.32 27.48,56.32 27.48,52.51 28.75,51.24
  pour Route15: 7.8,60.13 10.97,60.13 10.97,56.32 28.75,56.32 28.75,51.24 7.8,51.24
DAMPER_POS_OUT
  Top 0.254: H1.25 38.53,40.61 U2.17
GND  (via drill 0.5, 0.6)  (1 unrouted)
  Top 0.254: v36.37,26.48 37.01,27.11 38.86,27.11 U2.27 | C27.2 v30.66,31.56 | 51.09,27.63 54.27,27.63 v54.79,27.11 | C17.2 v30.66,29.02 | C20.2 v61.14,29.02 | C21.2 v51.61,39.18 | C19.2 v40.18,39.18 | U2.39 43.88,20.24 v43.99,20.13 | U2.12 42.88,36.48 42.09,37.27 v41.45,37.27 | v47.67,37.27 47.38,36.97 U2.3 | v48.44,16.95 48.44,17.9 C18.2
  Top 0.406: C4.2 59.65,26.06 v58.6,27.11 | R2.1 58.87,17.86 59.87,18.86 v59.87,19.49 | R6.1 97.33,51.24 97.97,51.24 v99.24,52.51 | C12.2 99.02,59.08 v98.6,59.5 | U4.8 v77.01,36 | U4.2 78.28,27.75 v77.65,27.11 | C22.2 C23.2 v84.63,30.29 | R18.1 v9.07,48.07 | LED18.3 38.09,59.5 v39.55,59.5 | LED17.3 50.15,59.5 v51.61,59.5 | LED16.3 62.21,59.5 v63.68,59.5 | LED15.3 73.64,59.5 v75.11,59.5 | LED14.3 85.08,59.5 v86.54,59.5 | LED13.3 125.72,59.5 v127.18,59.5 | LED12.3 119.56,49.15 v119.56,47.43 | LED11.3 100.06,30.92 v98.6,30.92 | LED8.3 95.43,27.3 v95.43,25.21 | LED7.3 92.89,18.41 v92.89,16.95 | LED2.3 80,23.3 v78.92,23.3 | LED4.3 79.11,9.33 v77.65,9.33 | LED1.3 63.23,34.1 v61.77,34.1 | LED10.3 90.35,49.78 v90.35,51.24 | LED9.3 87.81,43.81 v87.81,42.35
  other vias: 30.66,45.53 30.66,44.26 30.66,42.99 29.39,41.72 30.66,41.72 15.42,42.99 14.15,44.89 14.15,43.62 12.88,44.89 12.88,43.62 12.88,46.16 110.03,41.72 113.84,51.88 110.03,42.99 110.03,44.26 110.03,45.53 110.03,46.8 112.57,51.88 111.3,51.88 110.03,51.88 102.41,51.88 102.41,50.61 103.68,50.61 103.68,51.88 71.93,9.33 71.93,8.06 71.93,10.6 71.93,11.87 71.93,13.14 74.47,18.22 73.2,18.22 71.93,18.22 70.66,18.22 64.31,18.86 63.04,18.86 63.04,17.59 64.31,17.59
  pour Top (rank 2): 71.3,4.25 71.3,6.79 68.76,6.79 68.76,9.97 64.95,9.97 64.95,14.41 62.41,14.41 62.41,19.49 64.31,19.49 64.31,20.76 66.22,20.76 66.22,16.95 68.12,16.95 68.12,21.4 75.74,21.4 75.74,4.25
  pour Route2: -9.98,74.1 139.24,74.1 139.24,-4 -9.98,-4
  pour Top: 10.97,46.8 16.05,46.8 16.05,42.35 12.88,42.35 10.97,44.26
  pour Top: 28.75,46.8 31.29,46.8 31.29,41.08 28.75,41.08
  pour Top (rank 3): 110.03,37.91 110.03,40.45 108.13,40.45 107.49,47.43 103.68,47.43 103.68,49.97 101.78,49.97 101.78,52.51 104.32,52.51 104.32,53.78 105.59,53.78 105.59,50.61 107.49,50.61 107.49,51.24 106.86,51.24 106.86,54.42 115.11,54.42 115.11,37.91
IR_SENSOR_1_ANALOG_OUT
  Top 0.254: H1.30 54.15,36.23 54.15,30.92 53.52,30.29 52.88,30.29 52.54,30.63 U2.61
IR_SENSOR_1_DIGITAL_IN  (via drill 0.5)
  Top 0.254: U2.52 53.23,26.13 v54.79,24.57
  Bottom 0.254: H1.19 62.87,37.1 52.88,27.11 52.88,26.48 v54.79,24.57
IR_SENSOR_1_DIGITAL_OUT  (via drill 0.5)
  Top 0.254: v50.98,23.3 50.98,24.38 U2.49
  Bottom 0.254: v50.98,23.3 49.07,25.21 49.07,27.11 46.91,29.27 46.91,33.33 46.87,33.37 46.87,36.29 46.53,36.64 46.53,37.91 46.87,38.25 H1.15
IR_SENSOR_2_ANALOG_OUT
  Top 0.254: H1.29 53.52,39.6 53.52,31.56 53.09,31.13 U2.62
IR_SENSOR_2_DIGITAL_IN  (via drill 0.5)
  Top 0.254: U2.51 53.09,25.63 53.52,25.21 53.52,24.57 54.15,23.94 v54.15,23.3
  Bottom 0.254: H1.18 58.87,34.37 52.25,27.75 52.25,25.84 54.15,23.94 v54.15,23.3
IR_SENSOR_2_DIGITAL_OUT  (via drill 0.5)
  Top 0.254: v49.07,20.13 48.38,20.82 U2.48
  Bottom 0.254: H1.14 42.72,46.8 42.72,32.19 48.44,26.48 48.44,20.76 v49.07,20.13
IR_SENSOR_3_ANALOG_OUT
  Top 0.254: H1.28 52.88,42.95 52.88,32.19 52.32,31.63 U2.63
IR_SENSOR_3_DIGITAL_IN  (via drill 0.5)
  Top 0.254: U2.50 52.32,25.13 52.88,24.57 v52.88,23.94
  Bottom 0.254: H1.17 54.79,46.87 54.79,41.72 57.33,39.18 57.33,34.1 51.61,28.38 51.61,25.13 51.69,25.13 v52.88,23.94
IR_SENSOR_3_DIGITAL_OUT  (via drill 0.5)
  Top 0.254: v47.8,20.13 47.88,20.2 U2.47
  Bottom 0.254: H1.13 38.91,46.92 38.91,34.73 47.8,25.84 v47.8,20.13
N$1  (via drill 0.5)
  Top 0.254: LED1.6 72.18,37.65 74.47,35.37 v74.47,32.19 | v82.73,25.84 83.74,24.83 LED2.1
  Bottom 0.254: v74.47,32.19 74.47,27.75 76.38,25.84 80.82,25.84 81.46,26.48 82.09,26.48 v82.73,25.84
N$2
  Top 0.406: R4.2 LED5.C
N$3
  Top 0.406: LED3.C R9.2
N$4  (via drill 0.5)
  Top 0.406: U3.7 100.18,54.09 v99.87,53.78 | v101.78,56.32 101.78,58.59 R8.2
  Bottom 0.406: v99.87,53.78 99.87,54.42 v101.78,56.32
N$5
  Top 0.254: LED7.6 89.33,24.89 LED8.1
N$6
  Top 0.254: LED8.6 91.87,33.84 84.25,41.46 LED9.1
N$7
  Top 0.254: LED8.5 93.52,34.1 85.9,41.72 LED9.2
N$8
  Top 0.254: LED7.5 90.98,24.57 93.52,27.11 LED8.2
N$9  (via drill 0.5)
  Top 0.254: 62.41,25.57 R3.2
  Top 0.406: 62.41,25.57 v62.41,23.94 | U1.7 60.81,21.07 v60.5,20.76
  Bottom 0.406: v60.5,20.76 60.5,22.03 v62.41,23.94
N$10
  Top 0.254: LED2.6 83.74,15.43 82.73,14.41 79.55,14.41 78.92,13.78 78.92,13.2 LED4.1
N$11
  Top 0.406: LED6.C R18.2
N$12
  Top 0.254: LED4.5 86.54,11.24 90.98,15.68 LED7.2
N$13
  Top 0.254: LED4.6 86.92,12.89 89.08,15.05 89.08,18.29 LED7.1
N$14
  Top 0.254: LED10.6 94.16,43.69 94.16,39.81 99.49,34.48 LED11.1
N$15
  Top 0.254: LED2.5 82.09,15.68 81.46,15.05 78.92,15.05 77.65,13.78 77.65,11.87 78.28,11.24 LED4.2
N$16  (via drill 0.5)
  Top 0.254: LED1.5 72.57,36 73.2,35.37 v73.2,32.19 | v81.46,25.21 82.09,24.57 LED2.2
  Bottom 0.254: v73.2,32.19 73.2,27.75 75.74,25.21 v81.46,25.21
N$19
  Top 0.254: LED11.6 110.41,34.48 116.38,40.45 116.38,51.24 118.29,53.15 119.62,53.15 LED12.1
N$20
  Top 0.254: LED11.5 110.03,32.83 117.65,40.45 117.65,50.61 118.29,51.24 LED12.2
N$21
  Top 0.254: 99.24,32.83 LED11.2 98.6,32.83 97.97,33.46 97.97,34.73 92.25,40.45 LED10.5
N$22
  Top 0.254: LED9.6 84.25,51.5 85.9,53.15 92.25,53.15 93.9,51.5 LED10.1
N$23
  Top 0.254: LED9.5 85.9,51.24 87.17,52.51 90.98,52.51 92.25,51.24 LED10.2
N$24
  Top 0.254: LED13.6 118.67,55.94 113.84,60.77 92.25,60.77 87.42,55.94 LED14.1
N$25
  Top 0.254: LED14.6 LED15.1
N$26
  Top 0.254: LED14.5 LED15.2
N$27
  Top 0.254: LED13.5 118.92,57.59 115.11,61.4 91.62,61.4 87.81,57.59 LED14.2
N$28
  Top 0.254: LED13.1 126.92,55.94 127.81,55.05 127.81,53.78 126.92,52.89 LED12.6
N$29
  Top 0.254: LED12.5 127.18,51.24 128.45,52.51 128.45,56.32 127.18,57.59 LED13.2
N$30
  Top 0.254: LED16.6 LED17.1
N$31
  Top 0.254: LED17.6 LED18.1
N$32
  Top 0.254: LED17.5 LED18.2
N$33
  Top 0.254: LED16.5 LED17.2
N$34
  Top 0.254: LED15.5 LED16.2
N$35
  Top 0.254: LED15.6 LED16.1
P$40  (via drill 0.6)
  Top 0.254: U2.56 55.67,28.13 v56.06,28.38 | U2.25 36.62,28.13 v35.74,29.02 35.74,30.92 35.1,31.56 C27.1
  Bottom 0.254: v56.06,28.38 56.06,23.94 50.98,18.86 43.99,18.86 41.45,21.4 41.45,26.48 39.8,28.13 36.62,28.13 v35.74,29.02
PROGRAMMING_CAN_N
  Top 0.254: U4.6 79.55,38.23 R7.1 79.87,39.75 79.17,40.45 79.17,41.97 80.19,42.99 80.84,42.99 H1.35
PROGRAMMING_CAN_P
  Top 0.254: U4.7 78.28,38.23 R7.2 77.97,39.75 78.66,40.45 78.66,41.97 77.65,42.99 76.91,42.99 H1.34
PROGRAMMING_CAN_RX  (via drill 0.5)
  Top 0.254: U2.58 53.63,29.13 55.42,30.92 v75.74,30.92 | U4.4 81,29.02 82.09,29.02 v82.09,30.29
  Bottom 0.254: v75.74,30.92 81.46,30.92 v82.09,30.29
PROGRAMMING_CAN_TX
  Top 0.254: U2.57 54.4,28.63 56.06,30.29 75.11,30.29 76.38,29.02 76.83,29.02 U4.1
SPI_SCARY_LED_CLOCK  (via drill 0.5)
  Top 0.254: U2.30 36.8,25.63 36.37,25.21 36.37,23.94 37.01,23.3 39.55,23.3 v50.98,34.73 | 62.41,36 LED1.2 57.33,36 56.69,35.37 v55.42,35.37
  Bottom 0.254: v50.98,34.73 51.61,35.37 v55.42,35.37
SPI_SCARY_LED_TRANSMIT  (via drill 0.5)
  Top 0.254: U2.64 50.73,32.58 v51.61,33.46 | LED1.1 57.07,37.65 v56.06,36.64
  Bottom 0.254: v51.61,33.46 55.42,33.46 56.69,34.73 56.69,36 v56.06,36.64
SS_5V1
  Top 0.254: U1.5 62.13,22.73 C4.1
SS_5V2
  Top 0.406: U3.5 101.44,55.39 99.87,56.96 C12.1
STRAIN_GADGE_VOLTMETER_IN_0
  Top 0.254: H1.27 45.88,39.96 U2.6
STRAIN_GADGE_VOLTMETER_IN_1
  Top 0.254: H1.26 45.38,42.45 U2.7
SW_5V1  (via drill 0.5)
  Top 0.406: U1.2 66.54,21.07 66.85,20.76 v66.85,20.13
  other vias: 63.68,14.41 63.68,15.68 58.6,15.68 58.6,14.41 66.85,18.86 66.85,17.59 68.12,17.59
  pour Top: 57.96,16.95 64.31,16.95 64.31,9.97 57.96,9.97
  pour Bottom: 66.22,21.4 67.49,21.4 67.49,18.22 68.76,18.22 68.76,15.68 64.31,15.68 64.31,9.97 57.96,9.97 57.96,16.95 66.22,16.95
  pour Top: 66.22,21.4 67.49,21.4 67.49,18.22 68.76,18.22 68.76,16.95 66.22,16.95
SW_5V2  (via drill 0.5)  (1 unrouted)
  other vias: 97.97,47.43 106.22,53.78 106.22,52.51 106.22,51.24 107.49,51.24 97.97,48.7 103.05,47.43 103.05,48.7
  pour Bottom: 105.59,54.42 106.86,54.42 106.86,51.88 108.13,51.88 108.13,48.7 103.68,48.7 103.68,42.99 97.33,42.99 97.33,49.97 105.59,49.97
  pour Top: 97.33,49.97 103.68,49.97 103.68,42.99 97.33,42.99
  pour Top: 105.59,54.42 106.86,54.42 106.86,51.88 108.13,51.88 108.13,50.61 105.59,50.61
VBST_5V1
  Top 0.254: U1.8 62.07,20.42
  Top 0.406: 62.07,20.42 61.14,19.49 C5.1
VBST_5V2
  Top 0.406: U3.8 101.44,53.44 100.51,52.51 C13.1
VCC  (via drill 0.5)
  Top 0.406: U1.3 67.18,21.72 67.49,22.03 v67.49,22.67 | 20.5,44.26 U21.3 | U3.3 105.91,54.74 106.22,55.05 v106.22,55.69
  other vias: 25.58,44.26 25.58,42.99 21.77,42.99 20.5,42.99 24.31,42.99 21.77,44.26 113.84,56.96 112.57,56.96 111.3,56.96 110.03,56.96 104.32,56.96 64.95,23.94 68.76,24.57 70.03,24.57 71.3,24.57 72.57,24.57
  pour Top: 75.74,22.03 63.68,22.03 63.68,27.11 75.74,27.11
  pour Top: 27.48,44.89 27.48,42.35 19.86,42.35 19.86,46.16 21.13,46.16 22.4,44.89
  pour Top: 27.48,44.89 27.48,42.35 19.86,42.35 19.86,46.8 21.13,46.8 23.04,44.89
  pour Top (rank 2): 115.11,54.42 105.59,54.42 103.05,57.59 103.05,60.13 115.11,60.13
  pour Route15 (rank 5): -4.27,69.66 136.07,69.66 136.07,-5.91 -4.27,-5.91
VFB_5V1
  Top 0.406: U1.6 58.91,21.72 58.6,22.03 58.23,22.03 R1.1 R2.2
VFB_5V2
  Top 0.406: R6.2 R5.1 97.91,54.74 U3.6
WHEEL_SPEED_OUT
  Top 0.254: 34.47,42.99 33.83,43.62 R10.1 | H1.24 36.84,42.99 34.47,42.99 | 34.47,42.99 33.83,42.35 33.83,41.72 36.37,39.18 36.37,30.92 37.16,30.13 U2.21